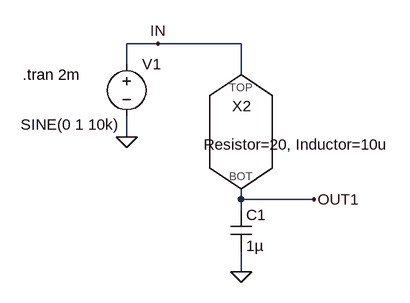
[diagram p0: schematic Fig_2-176_RL_Network-TOP.asc]
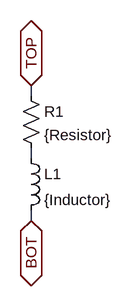
[diagram p1: sub-circuit fig_2-173_rl_element.asc]
Fig_2-176_RL_Network-TOP.asc, the LTspice schematic file:
Version 4
SHEET 1 1148 680
WIRE 128 48 80 48
WIRE 256 48 128 48
WIRE 80 80 80 48
WIRE 256 96 256 48
WIRE 80 192 80 160
WIRE 256 288 256 272
WIRE 368 288 256 288
WIRE 256 304 256 288
WIRE 256 400 256 368
FLAG 256 400 0
FLAG 80 192 0
FLAG 368 288 OUT1
FLAG 128 48 IN
SYMBOL voltage 80 64 R0
WINDOW 3 -163 109 Left 2
WINDOW 123 0 0 Left 2
WINDOW 39 0 0 Left 2
SYMATTR Value SINE(0 1 10k)
SYMATTR InstName V1
SYMBOL cap 240 304 R0
SYMATTR InstName C1
SYMATTR Value 1µ
SYMBOL Fig_2-173_RL_Element 256 160 R0
WINDOW 3 85 59 Bottom 2
SYMATTR Value Resistor=20, Inductor=10u
SYMATTR InstName X2
SYMATTR SpiceModel Fig_2-173_RL_Element.asc
TEXT -80 96 Left 2 !.tran 2m

fig_2-173_rl_element.asc, the sub-circuit schematic file:
Version 4
SHEET 1 880 680
WIRE 192 96 192 80
WIRE 192 192 192 176
WIRE 192 288 192 272
FLAG 192 80 TOP
IOPIN 192 80 BiDir
FLAG 192 288 BOT
IOPIN 192 288 BiDir
SYMBOL res 176 80 R0
SYMATTR InstName R1
SYMATTR Value {Resistor}
SYMBOL ind 176 176 R0
SYMATTR InstName L1
SYMATTR Value {Inductor}

The netlist it stands for:
* Fig_2-176_RL_Network-TOP.asc
V1 IN 0 SINE(0 1 10k)
C1 OUT1 0 1µ
XX2 OUT1 IN fig_2-173_rl_element params: Resistor=20, Inductor=10u

* block symbol definitions
.subckt fig_2-173_rl_element BOT TOP
R1 TOP N001 {Resistor}
L1 N001 BOT {Inductor}
.ends fig_2-173_rl_element

.tran 2m
.backanno
.end